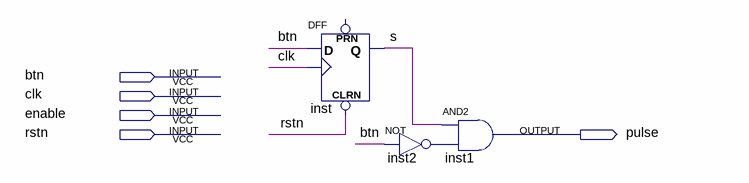
[diagram p0: schematic sheet]
// Quartus schematic Start.bdf as structural Verilog: 3 symbols, 5 pins
module Start (
  input  btn,
  input  clk,
  input  enable,
  input  rstn,
  output pulse
);

  wire inst2_out, s;

  DFF inst (.CLRN(rstn), .CLK(clk), .D(btn), .Q(s));  // open: PRN
  not inst2 (inst2_out, btn);
  and inst1 (pulse, s, inst2_out);
endmodule
